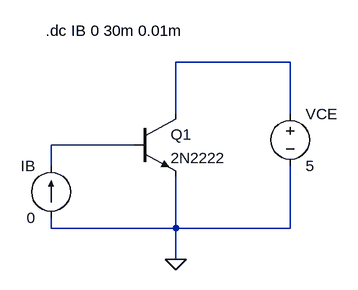
[diagram p0: schematic npn_Ib-Ic.asc]
npn_Ib-Ic.asc, the LTspice schematic file:
Version 4
SHEET 1 880 776
WIRE 432 32 256 32
WIRE 256 112 256 32
WIRE 432 112 432 32
WIRE 192 160 64 160
WIRE 64 192 64 160
WIRE 64 288 64 272
WIRE 256 288 256 208
WIRE 256 288 64 288
WIRE 432 288 432 192
WIRE 432 288 256 288
WIRE 256 336 256 288
FLAG 256 336 0
SYMBOL npn 192 112 R0
SYMATTR InstName Q1
SYMATTR Value 2N2222
SYMBOL voltage 432 96 R0
WINDOW 123 0 0 Left 0
WINDOW 39 0 0 Left 0
SYMATTR InstName VCE
SYMATTR Value 5
SYMBOL current 64 272 R180
WINDOW 0 24 80 Left 2
WINDOW 3 24 0 Left 2
WINDOW 123 0 0 Left 0
WINDOW 39 0 0 Left 0
SYMATTR InstName IB
SYMATTR Value 0
TEXT 56 -16 Left 2 !.dc IB 0 30m 0.01m

The netlist it stands for:
* npn_Ib-Ic.asc
Q1 N001 N002 0 0 2N2222
VCE N001 0 5
IB 0 N002 0
.model NPN NPN
.model PNP PNP
.lib standard.bjt
.dc IB 0 30m 0.01m
.backanno
.end